# Altium schematic sheet ADC-QCHANNEL INPUT.SchDoc: <SPECIFIC SHEET FUNCTION>
size A3; Date: DO NOT USE, RATHER USE PROJ OPTIONS; DrawnBy: DO NOT USE, RATHER USE PROJ OPTIONS; Engineer: DO NOT USE, RATHER USE PROJ OPTIONS; Organization: DO NOT USE, RATHER USE PROJ OPTIONS; DocumentNumber: 2; Revision: DO NOT USE, RATHER USE PROJ OPTIONS; SheetNumber: 2; SheetTotal: 12; SCH_Sheet_Filename: ADC-QCHANEL INPUT.SchDoc; CurrentTime: DO NOT USE, RATHER USE PROJ OPTIONS; Time: DO NOT USE, RATHER USE PROJ OPTIONS; DocumentFullPathAndName: DO NOT USE, RATHER USE PROJ OPTIONS; DocumentName: DO NOT USE, RATHER USE PROJ OPTIONS; ModifiedDate: DO NOT USE, RATHER USE PROJ OPTIONS; ImagePath: DO NOT USE, RATHER USE PROJ OPTIONS
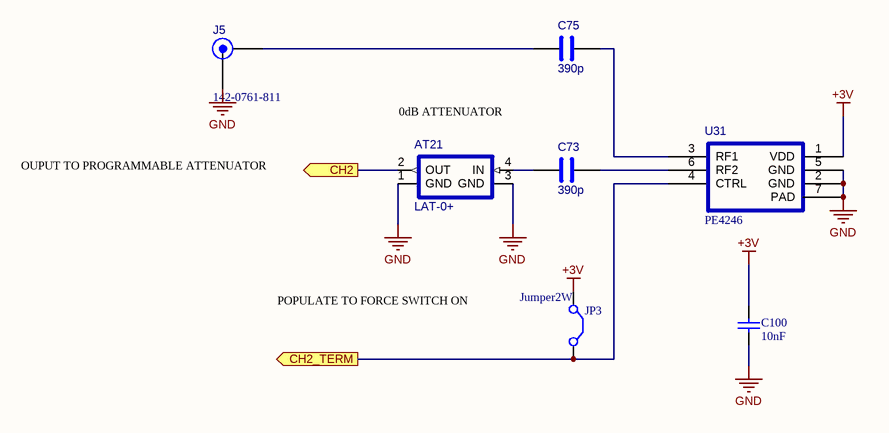
[diagram p0: ADC-QCHANNEL INPUT.SchDoc]

## Parts
AT21  (no value)  [MINICIRCUITS_MMM168]
C73  value 390p  [CAPC1005X55N]  (hidden comment: *)
C75  value 390p  [CAPC1005X55N]  (hidden comment: *)
C100  value 10nF  [CAPC1005X55N]  (hidden comment: Capacitor 0402 SMD)
J5  (no value)  [EDGE_LAUNCH_TH_SMA]
JP3  Jumper2W  [JUMPER]
U31  PE4246  [PSON95P300X300X90-7USR]

## Ports
CH2 (out), CH2_TERM (out)

## Nets
+3V: C100.1 JP3.1(C1) U31.1(VDD)
GND: AT21.1(GND) AT21.3(GND) C100.2 J5.2 U31.2(GND) U31.5(GND) U31.7(PAD)
CH2: AT21.2(OUT) ; port CH2
CH2_TERM: JP3.2(C2) U31.4(CTRL) ; port CH2_TERM
NetAT21_4: AT21.4(IN) C73.2
NetC73_1: C73.1 U31.6(RF2)
NetC75_1: C75.1 J5.1
NetC75_2: C75.2 U31.3(RF1)

## Notes on the sheet
- 0dB ATTENUATOR
- OUPUT TO PROGRAMMABLE ATTENUATOR
- POPULATE TO FORCE SWITCH ON
- 2009   THIS DOCUMENT IS THE PROPERTY OF THE OWNER, AND MAY NOT BE COPIED OR USED FOR ANY PURPOSE OTHER THAN THAT FOR WHICH IT IS SUPPLIED WITHOUT PERMISSION IN WRITING FROM THE OWNER.
- C
- DATESTAMP OF THIS PRINT
- DRAWN BY:
- DOCUMENT NUMBER:
- SCHEMATIC FILENAME:
- PCB FILENAME:
- ENGINEER:
- APPROVED:
- CIRCUIT DIAGRAM
- DATE
- SHEET
- REVISION
- OF

## Library data of the parts
AT21 = LAT-0+: Fixed Attenuator; Manufacturer: Mini-Circuits; Created_By: CT; Checked_By: *; Checked_Date: *; HelpURL: X:\Datasheets\By_Manufacturer\Mini Circuits\LAT-0+.pdf; ComponentLink1Description: Fixed Attenuator; ComponentLink1URL: *; ComponentLink2Description: Application Note; ComponentLink2URL: *; ComponentLink3Description: Layout Guidelines; ComponentLink3URL: *; ComponentLink4Description: Technology Reference; ComponentLink4URL: *; Supplier1: *; Supplier2: *; Unit_Cost: *; MOQ: *; Leadtime: *; Inventory_Stock: *; Tolerance: *; Wattage: *; Voltage: *; Package: *; ComponentLink5Description: Production Detail; ComponentLink5URL: *; Note: *; Stock Code: *; Manufacturer_PN: LAT-0+
C73 C75 = CAP-0603: CAP SMD 0603; Manufacturer: *; Manufacturer_PN: *; Created_By: *; Checked_By: *; Checked_Date: *; HelpURL: *; ComponentLink1Description: Footprint Detail; ComponentLink1URL: *; ComponentLink2Description: Application Note; ComponentLink2URL: *; ComponentLink3Description: Layout Guidelines; ComponentLink3URL: *; ComponentLink4Description: Technology Reference; ComponentLink4URL: *; Supplier1: *; Supplier2: *; Unit_Cost: *; MOQ: *; Leadtime: *; Inventory_Stock: *; Tolerance: *; Wattage: *; Voltage: *; Package: 0603; ComponentLink5Description: Production Detail; ComponentLink5URL: *; Note: *; Stock Code: *
C100 = cap0402: Created_By: EDA-ASA; Checked_By: *; Checked_Date: *; HelpURL: *; Supplier1: *; Supplier2: *; Unit_Cost: *; MOQ: *; Leadtime: *; Inventory_Stock: *; Tolerance: *; Wattage: *; Package: 0402; ComponentLinked1Description: *; ComponentLinked1URL: *; ComponentLinked2Description: *; ComponentLinked2URL: *; ComponentLinked3Description: *; ComponentLinked3URL: *; ComponentLinked4Description: *; ComponentLinked4URL: *
J5 = 142-0761-811: High Frequency SMA End Lauch Connector; Manufacturer: JOHNSON; Created_By: CT; Voltage: ???; Checked_By: *; Checked_Date: *; HelpURL: *; ComponentLink1Description: High Frequency SMA End Lauch Connector; ComponentLink1URL: *; ComponentLink2Description: Application Note; ComponentLink2URL: *; ComponentLink3Description: Layout Guidelines; ComponentLink3URL: *; ComponentLink4Description: Technology Reference; ComponentLink4URL: *; Supplier1: *; Supplier2: *; Unit_Cost: *; MOQ: *; Leadtime: *; Inventory_Stock: *; Tolerance: *; Wattage: *; Package: *; ComponentLink5Description: Production Detail; ComponentLink5URL: *; Note: *; Stock Code: *; Manufacturer_PN: 142-0761-811
JP3 = Jumper2W: Jumper Wire; Published: 24-Mar-1999; LatestRevisionDate: 17-Jul-2002; LatestRevisionNote: Re-released for DXP Platform.; PackageReference: RAD-0.2; Publisher: Altium Limited
U31 = PE4246: Absorptive SPST UltraCMOS RF Switch; Manufacturer: Pergrime Semiconductor; Created_By: IN; Manufacturer_PN: PE4246; Checked_By: *; Checked_Date: *; HelpURL: X:\Datasheets\By Manufacturer\Pergrime\pe4246ds.pdf; ComponentLink1Description: X:\Datasheets\By Manufacturer\Pergrime\pe4246ds.pdf#page=5; ComponentLink1URL: *; ComponentLink2Description: Application Note; ComponentLink2URL: *; ComponentLink3Description: Layout Guidelines; ComponentLink3URL: *; ComponentLink4Description: Technology Reference; ComponentLink4URL: *; Supplier1: *; Supplier2: *; Unit_Cost: *; MOQ: *; Leadtime: *; Inventory_Stock: *; Tolerance: *; Wattage: *; Voltage: *; Package: *; ComponentLink5Description: Production Detail; ComponentLink5URL: *; Note: *; Stock Code: *